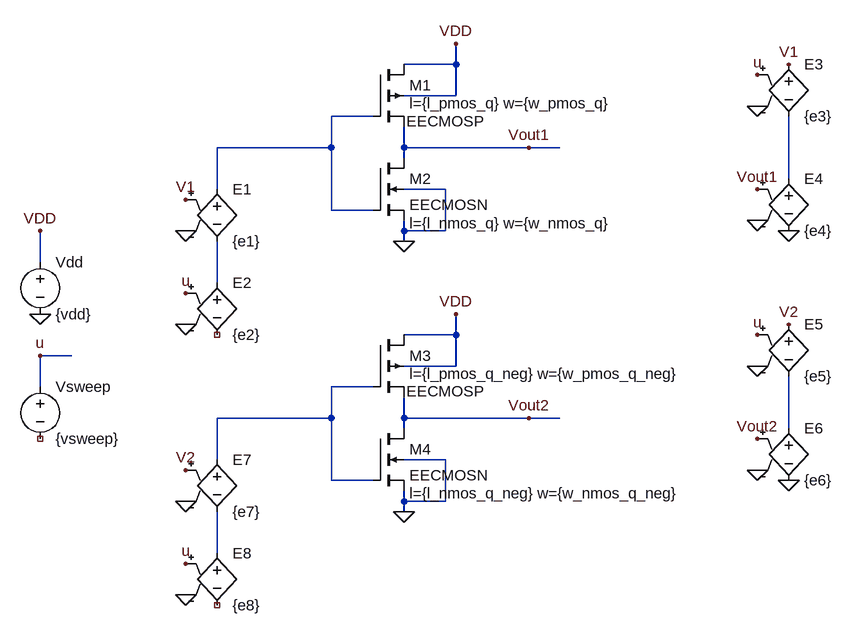
[diagram p0: schematic seevinck_circuit.asc]
seevinck_circuit.asc, the LTspice schematic file:
Version 4
SHEET 1 2120 768
WIRE 576 -160 576 -192
WIRE 576 -160 496 -160
WIRE 576 -112 576 -160
WIRE 576 -112 496 -112
WIRE 448 -80 384 -80
WIRE 384 -32 384 -80
WIRE 384 -32 208 -32
WIRE 496 -32 496 -64
WIRE 688 -32 496 -32
WIRE 736 -32 688 -32
WIRE 496 -16 496 -32
WIRE 1088 16 1088 -80
WIRE 208 32 208 -32
WIRE 560 32 496 32
WIRE 384 64 384 -32
WIRE 448 64 384 64
WIRE 496 96 496 80
WIRE 560 96 560 32
WIRE 560 96 496 96
WIRE 496 112 496 96
WIRE -64 144 -64 96
WIRE 208 176 208 112
WIRE 576 256 576 224
WIRE 576 256 496 256
WIRE -16 288 -64 288
WIRE 576 304 576 256
WIRE 576 304 496 304
WIRE -64 336 -64 288
WIRE 448 336 384 336
WIRE 384 384 384 336
WIRE 384 384 208 384
WIRE 496 384 496 352
WIRE 688 384 496 384
WIRE 736 384 688 384
WIRE 496 400 496 384
WIRE 1088 400 1088 320
WIRE 208 448 208 384
WIRE 560 448 496 448
WIRE 384 480 384 384
WIRE 448 480 384 480
WIRE 496 512 496 496
WIRE 560 512 560 448
WIRE 560 512 496 512
WIRE 496 528 496 512
WIRE 208 592 208 528
FLAG -64 288 u
FLAG 160 96 0
FLAG 160 240 0
FLAG 160 192 u
FLAG 160 48 V1
FLAG 496 112 0
FLAG 688 -32 Vout1
FLAG 1088 96 0
FLAG 1040 80 0
FLAG 1040 -96 0
FLAG 1040 -144 u
FLAG 1040 32 Vout1
FLAG 1088 -160 V1
FLAG 1040 304 0
FLAG 1088 480 0
FLAG 1040 464 0
FLAG 1040 256 u
FLAG 1088 240 V2
FLAG 1040 416 Vout2
FLAG 160 512 0
FLAG 160 656 0
FLAG 160 608 u
FLAG 160 464 V2
FLAG 496 528 0
FLAG -64 224 0
FLAG 688 384 Vout2
FLAG 576 -192 VDD
FLAG 576 224 VDD
FLAG -64 96 VDD
SYMBOL voltage -64 320 R0
WINDOW 123 0 0 Left 0
WINDOW 39 0 0 Left 0
SYMATTR InstName Vsweep
SYMATTR Value {vsweep}
SYMBOL e 208 16 R0
SYMATTR InstName E1
SYMATTR Value {e1}
SYMBOL e 208 160 R0
SYMATTR InstName E2
SYMATTR Value {e2}
SYMBOL pmos4 448 -160 R0
WINDOW 3 52 87 Left 2
WINDOW 123 56 60 Left 2
SYMATTR Value EECMOSP
SYMATTR Value2 l={l_pmos_q} w={w_pmos_q}
SYMATTR InstName M1
SYMBOL nmos4 448 -16 R0
WINDOW 123 56 100 Left 2
SYMATTR Value2 l={l_nmos_q} w={w_nmos_q}
SYMATTR InstName M2
SYMATTR Value EECMOSN
SYMBOL e 1088 -176 R0
SYMATTR InstName E3
SYMATTR Value {e3}
SYMBOL e 1088 0 R0
SYMATTR InstName E4
SYMATTR Value {e4}
SYMBOL e 1088 224 R0
SYMATTR InstName E5
SYMATTR Value {e5}
SYMBOL e 1088 384 R0
SYMATTR InstName E6
SYMATTR Value {e6}
SYMBOL e 208 432 R0
SYMATTR InstName E7
SYMATTR Value {e7}
SYMBOL e 208 576 R0
SYMATTR InstName E8
SYMATTR Value {e8}
SYMBOL pmos4 448 256 R0
WINDOW 3 52 87 Left 2
WINDOW 123 56 60 Left 2
SYMATTR Value EECMOSP
SYMATTR Value2 l={l_pmos_q_neg} w={w_pmos_q_neg}
SYMATTR InstName M3
SYMBOL nmos4 448 400 R0
WINDOW 123 56 100 Left 2
SYMATTR Value2 l={l_nmos_q_neg} w={w_nmos_q_neg}
SYMATTR InstName M4
SYMATTR Value EECMOSN
SYMBOL voltage -64 128 R0
WINDOW 123 0 0 Left 0
WINDOW 39 0 0 Left 0
SYMATTR InstName Vdd
SYMATTR Value {vdd}

The netlist it stands for:
* seevinck_circuit.asc
Vsweep u NC_01 {vsweep}
E1 N001 N003 V1 0 {e1}
E2 N003 NC_02 u 0 {e2}
M1 VDD N001 Vout1 VDD EECMOSP l={l_pmos_q} w={w_pmos_q}
M2 Vout1 N001 0 0 EECMOSN l={l_nmos_q} w={w_nmos_q}
E3 V1 N002 u 0 {e3}
E4 N002 0 Vout1 0 {e4}
E5 V2 N005 u 0 {e5}
E6 N005 0 Vout2 0 {e6}
E7 N004 N006 V2 0 {e7}
E8 N006 NC_03 u 0 {e8}
M3 VDD N004 Vout2 VDD EECMOSP l={l_pmos_q_neg} w={w_pmos_q_neg}
M4 Vout2 N004 0 0 EECMOSN l={l_nmos_q_neg} w={w_nmos_q_neg}
Vdd VDD 0 {vdd}
.model NMOS NMOS
.model PMOS PMOS
.lib standard.mos
.backanno
.end